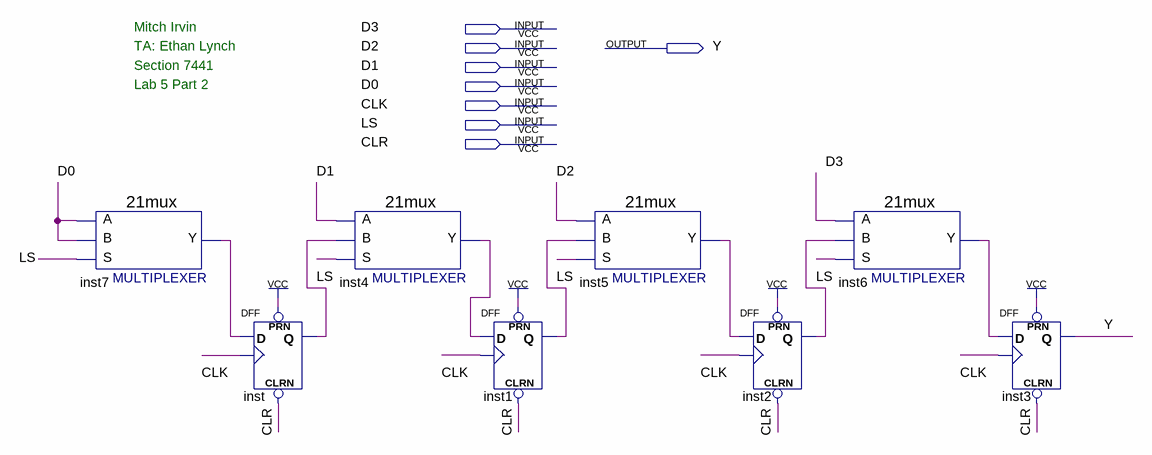
[diagram p0: schematic sheet]
// Quartus schematic lab5part2.bdf as structural Verilog: 8 symbols, 8 pins
module lab5part2 (
  input  D3,
  input  D2,
  input  D1,
  input  D0,
  input  CLK,
  input  LS,
  input  CLR,
  output Y
);

  wire inst1_q, inst2_q, inst4_y, inst5_y, inst6_y, inst7_y, inst_q;

  \21mux  inst7 (.S(LS), .B(D0), .A(D0), .Y(inst7_y));
  DFF inst (.CLRN(CLR), .CLK(CLK), .D(inst7_y), .PRN(1'b1), .Q(inst_q));
  \21mux  inst4 (.S(LS), .B(inst_q), .A(D1), .Y(inst4_y));
  DFF inst1 (.CLRN(CLR), .CLK(CLK), .D(inst4_y), .PRN(1'b1), .Q(inst1_q));
  \21mux  inst5 (.S(LS), .B(inst1_q), .A(D2), .Y(inst5_y));
  DFF inst2 (.CLRN(CLR), .CLK(CLK), .D(inst5_y), .PRN(1'b1), .Q(inst2_q));
  \21mux  inst6 (.S(LS), .B(inst2_q), .A(D3), .Y(inst6_y));
  DFF inst3 (.CLRN(CLR), .CLK(CLK), .D(inst6_y), .PRN(1'b1), .Q(Y));

  // Notes on the sheet:
  //   Mitch Irvin
  //   TA: Ethan Lynch
  //   Section 7441
  //   Lab 5 Part 2
endmodule
